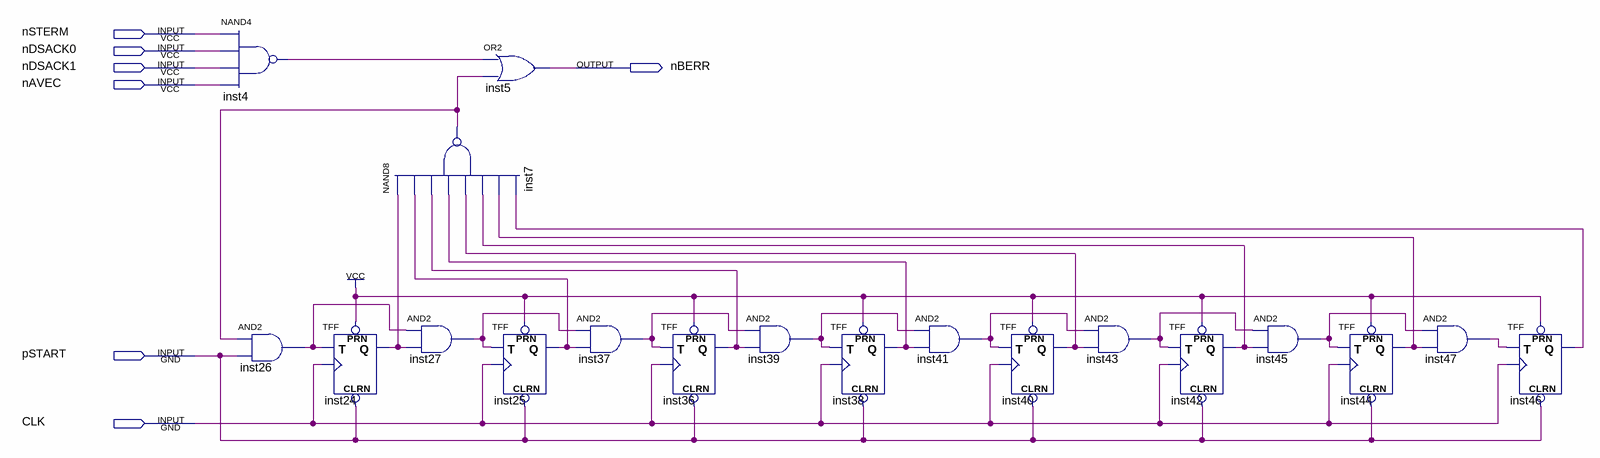
[diagram p0: schematic sheet]
// Quartus schematic BERR030.bdf as structural Verilog: 19 symbols, 7 pins
module BERR030 (
  input  nSTERM,
  input  nDSACK0,
  input  nDSACK1,
  input  nAVEC,
  input  pSTART,
  input  CLK,
  output nBERR
);

  wire inst4_out, inst7_out, inst24_q, inst25_q, inst26_out, inst27_out, inst36_q, inst37_out, inst38_q,
       inst39_out, inst40_q, inst41_out, inst42_q, inst43_out, inst44_q, inst45_out, inst46_q, inst47_out;

  nand inst4 (inst4_out, nSTERM, nDSACK0, nDSACK1, nAVEC);
  and inst26 (inst26_out, inst7_out, pSTART);
  TFF inst24 (.PRN(1'b1), .CLRN(pSTART), .T(inst26_out), .CLK(CLK), .Q(inst24_q));
  nand inst7 (inst7_out, inst24_q, inst25_q, inst36_q, inst38_q, inst40_q, inst42_q, inst44_q, inst46_q);
  and inst27 (inst27_out, inst26_out, inst24_q);
  or inst5 (nBERR, inst4_out, inst7_out);
  TFF inst25 (.PRN(1'b1), .CLRN(pSTART), .T(inst27_out), .CLK(CLK), .Q(inst25_q));
  and inst37 (inst37_out, inst27_out, inst25_q);
  TFF inst36 (.PRN(1'b1), .CLRN(pSTART), .T(inst37_out), .CLK(CLK), .Q(inst36_q));
  and inst39 (inst39_out, inst37_out, inst36_q);
  TFF inst38 (.PRN(1'b1), .CLRN(pSTART), .T(inst39_out), .CLK(CLK), .Q(inst38_q));
  and inst41 (inst41_out, inst39_out, inst38_q);
  TFF inst40 (.PRN(1'b1), .CLRN(pSTART), .T(inst41_out), .CLK(CLK), .Q(inst40_q));
  and inst43 (inst43_out, inst41_out, inst40_q);
  TFF inst42 (.PRN(1'b1), .CLRN(pSTART), .T(inst43_out), .CLK(CLK), .Q(inst42_q));
  and inst45 (inst45_out, inst43_out, inst42_q);
  TFF inst44 (.PRN(1'b1), .CLRN(pSTART), .T(inst45_out), .CLK(CLK), .Q(inst44_q));
  and inst47 (inst47_out, inst45_out, inst44_q);
  TFF inst46 (.PRN(1'b1), .CLRN(pSTART), .T(inst47_out), .CLK(CLK), .Q(inst46_q));
endmodule
